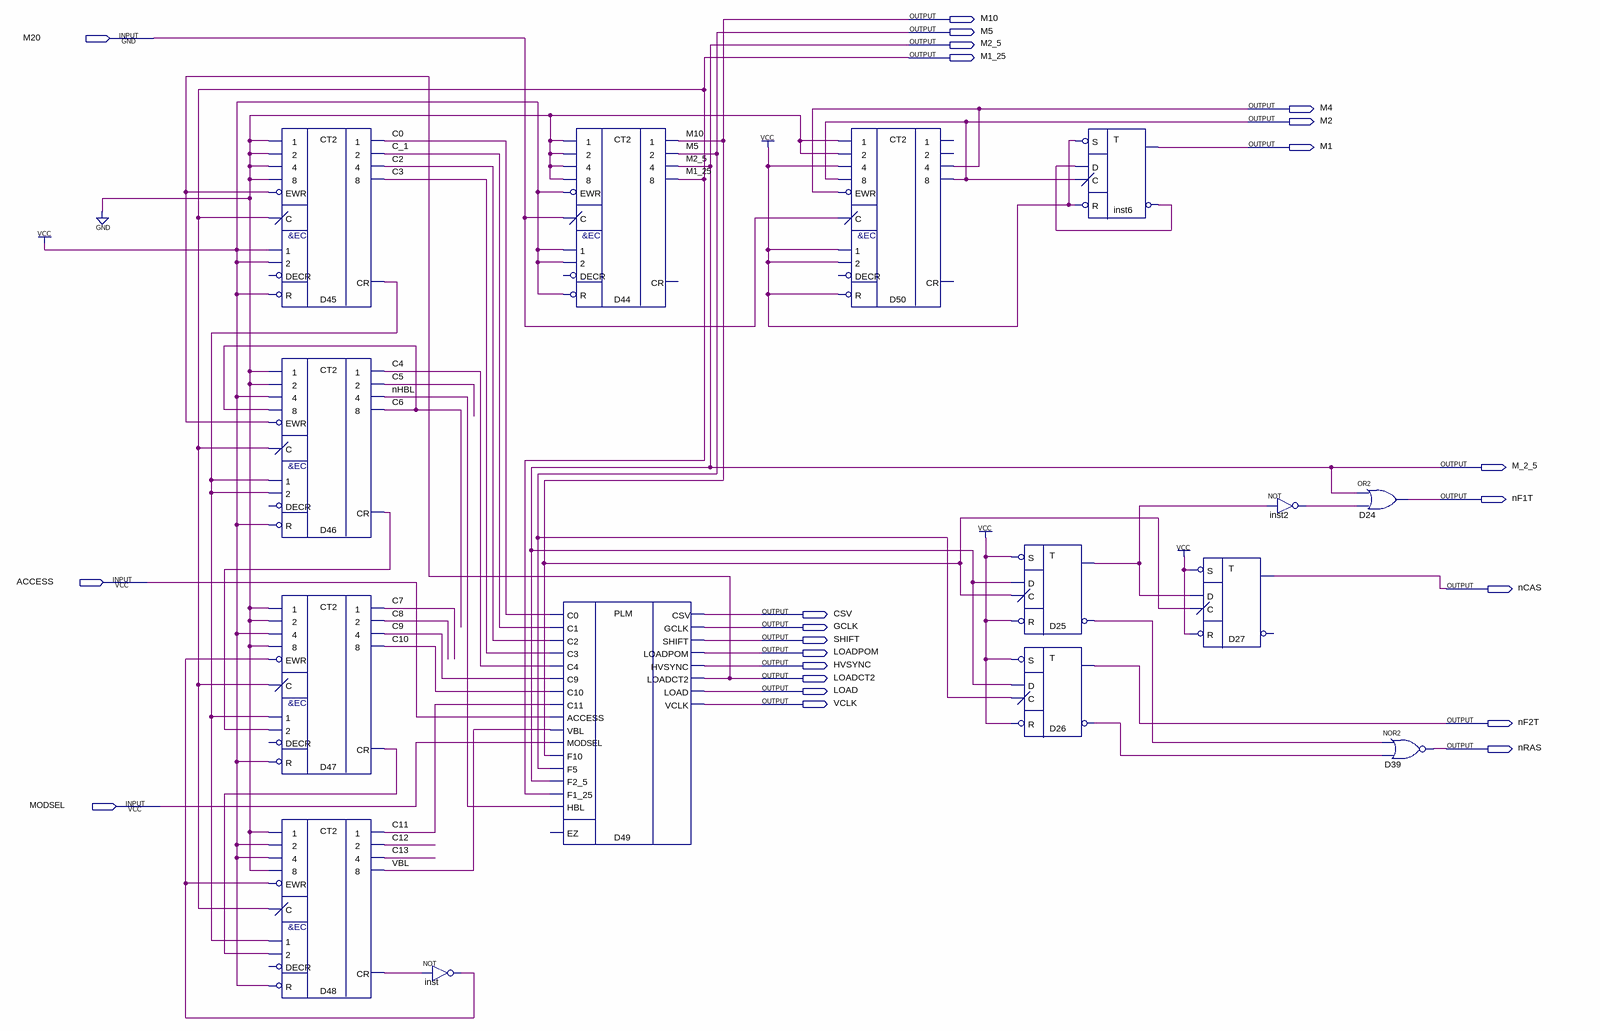
[diagram p0: schematic sheet]
// Quartus schematic Scheme.bdf as structural Verilog: 15 symbols, 23 pins
module Scheme (
  input  M20,
  input  ACCESS,
  input  MODSEL,
  output M10,
  output M5,
  output M2_5,
  output M1_25,
  output M4,
  output M2,
  output M1,
  output M_2_5,
  output nF1T,
  output nCAS,
  output CSV,
  output GCLK,
  output SHIFT,
  output LOADPOM,
  output HVSYNC,
  output LOADCT2,
  output LOAD,
  output VCLK,
  output nF2T,
  output nRAS
);

  wire C0, C2, C3, C4, C5, C6, C7, C8, C9, C10, C11, C12, C13, C_1, D25_rf, D25_ri, D25_RI_inverted_out,
       D26_ri, D26_RI_inverted_out, D45_cr, D46_cr, D47_cr, D48_cr, inst2_out, inst6_ri,
       inst6_RI_inverted_out, inst_out, nHBL, VBL;

  CT2 D45 (
    .C(M1_25), .D0(1'b0), .D1(1'b0), .D2(1'b0), .D3(1'b0), .E1(1'b1), .E2(1'b1), .notEWR(~LOADCT2),
    .notR(~1'b1), .CR(D45_cr), .OUT0(C0), .OUT1(C_1), .OUT2(C2), .OUT3(C3));  // open: notDECR
  CT2 D46 (
    .C(M1_25), .D0(1'b0), .D1(1'b0), .D2(1'b1), .D3(C6), .E1(D45_cr), .E2(D45_cr), .notEWR(~LOADCT2),
    .notR(~1'b1), .CR(D46_cr), .OUT0(C4), .OUT1(C5), .OUT2(nHBL), .OUT3(C6));  // open: notDECR
  CT2 D47 (
    .C(M1_25), .D0(1'b0), .D1(1'b0), .D2(1'b1), .D3(1'b0), .E1(D45_cr), .E2(D46_cr), .notEWR(~inst_out),
    .notR(~1'b1), .CR(D47_cr), .OUT0(C7), .OUT1(C8), .OUT2(C9), .OUT3(C10));  // open: notDECR
  CT2 D48 (
    .C(M1_25), .D0(1'b0), .D1(1'b1), .D2(1'b1), .D3(1'b0), .E1(D45_cr), .E2(D47_cr), .notEWR(~inst_out),
    .notR(~1'b1), .CR(D48_cr), .OUT0(C11), .OUT1(C12), .OUT2(C13), .OUT3(VBL));  // open: notDECR
  not inst (inst_out, D48_cr);
  CT2 D44 (
    .C(M20), .D0(1'b0), .D1(1'b0), .D2(1'b0), .D3(1'b0), .E1(1'b1), .E2(1'b1), .notEWR(~1'b1), .notR(~1'b1),
    .OUT0(M10), .OUT1(M5), .OUT2(M2_5), .OUT3(M1_25));  // open: notDECR, CR
  PLM D49 (
    .C0(C0), .C1(C_1), .C2(C2), .C3(C3), .C4(C4), .C9(C9), .C10(C10), .C11(C11), .ACCESS(ACCESS), .VBL(VBL),
    .MODSEL(MODSEL), .F10(M10), .F5(M5), .F2_5(M2_5), .F1_25(M1_25), .HBL(nHBL), .CSV(CSV), .GCLK(GCLK),
    .SHIFT(SHIFT), .LOADPOM(LOADPOM), .HVSYNC(HVSYNC), .LOADCT2(LOADCT2), .LOAD(LOAD), .VCLK(VCLK));  // open: EZ
  CT2 D50 (
    .C(M20), .D0(1'b0), .D1(1'b0), .D2(1'b1), .D3(M2), .E1(1'b1), .E2(1'b1), .notEWR(~M4), .notR(~1'b1),
    .OUT2(M4), .OUT3(M2));  // open: notDECR, CR, OUT0, OUT1
  T D25 (.C(M10), .D(M2_5), .R(~1'b1), .S(~1'b1), .RF(D25_rf), .RI(D25_ri));
  not D25_RI_inverted (D25_RI_inverted_out, D25_ri);
  T D26 (.C(M5), .D(M2_5), .R(~1'b1), .S(~1'b1), .RF(nF2T), .RI(D26_ri));
  not D26_RI_inverted (D26_RI_inverted_out, D26_ri);
  T inst6 (.C(M2), .D(inst6_RI_inverted_out), .R(~1'b1), .S(~1'b1), .RF(M1), .RI(inst6_ri));
  not inst6_RI_inverted (inst6_RI_inverted_out, inst6_ri);
  T D27 (.C(M10), .D(D25_rf), .R(~1'b1), .S(~1'b1), .RF(nCAS));  // open: RI
  not inst2 (inst2_out, D25_rf);
  or D24 (nF1T, M2_5, inst2_out);
  nor D39 (nRAS, D25_RI_inverted_out, D26_RI_inverted_out);

  assign M_2_5 = M2_5;
endmodule
